# EAGLE schematic 1 (EAGLE 6.4)
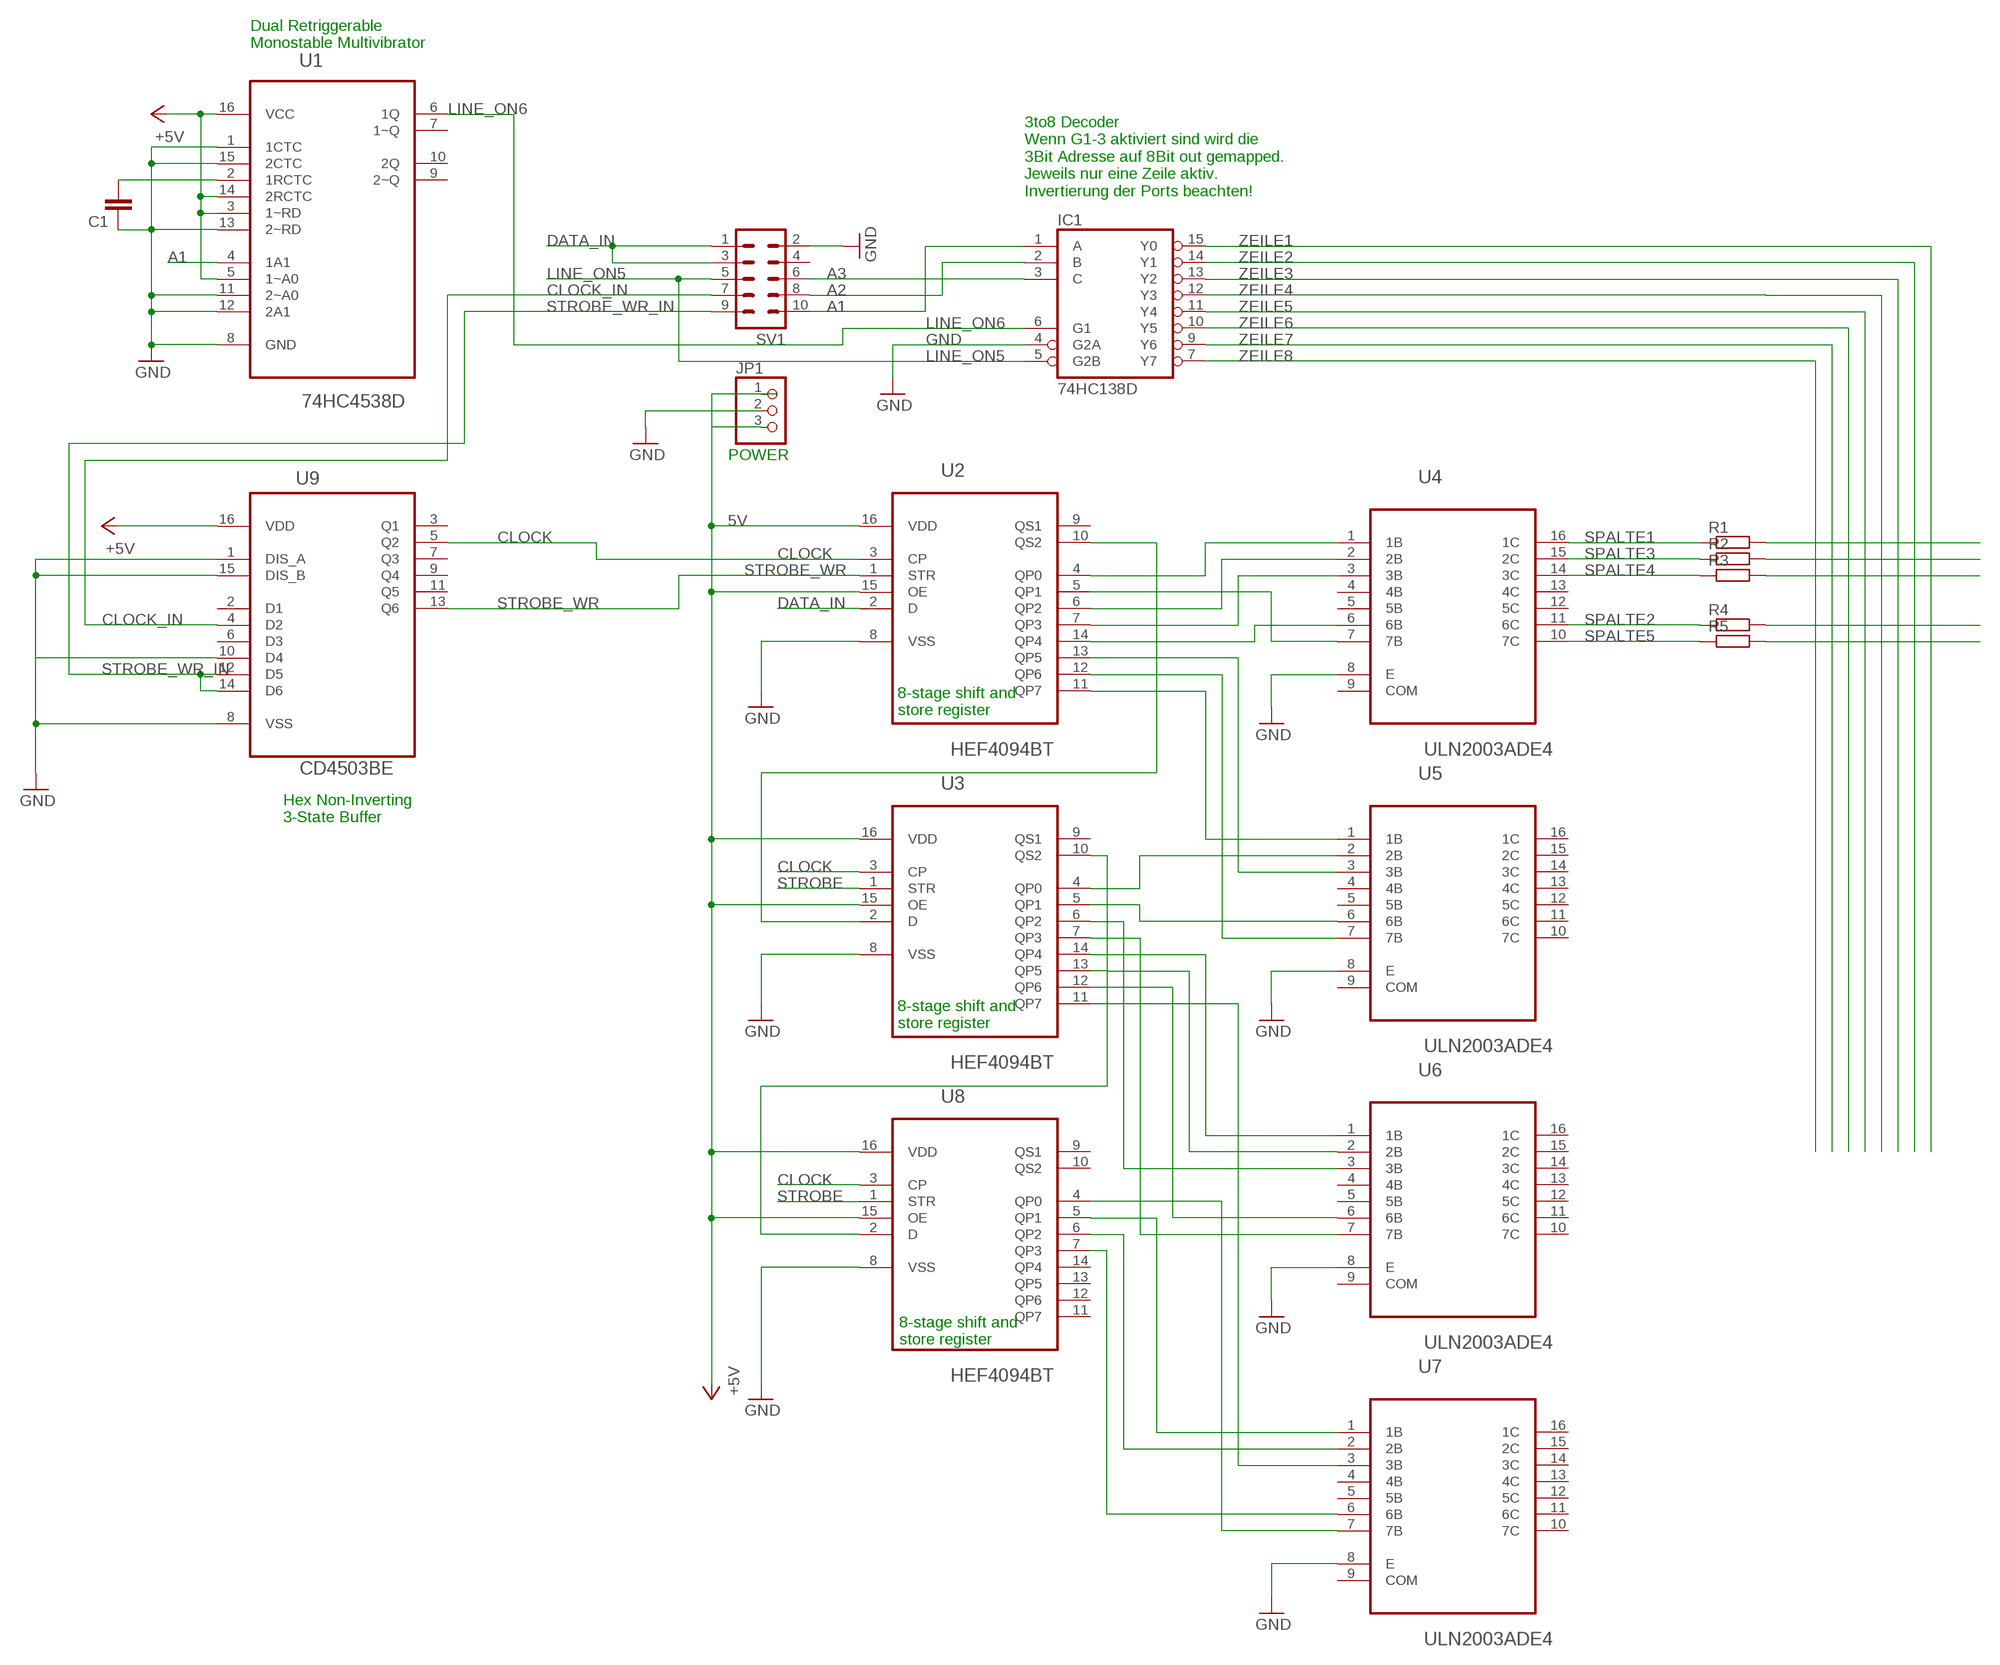
[diagram p0: schematic, sheet 1]

## Parts
C1  C-EU025-050X050  [C025-050X050]
IC1  74HC138D  [SO16]
JP1  PINHD-1X3  [1X03]
R1  R-EU_0414/15  [0414/15]
R2  R-EU_0414/15  [0414/15]
R3  R-EU_0414/15  [0414/15]
R4  R-EU_0414/15  [0414/15]
R5  R-EU_0414/15  [0414/15]
SV1  ML10  [ML10]
U1  74HC4538D  [SOIC127P600X175-16N]
U2  HEF4094BT  [SOIC127P600X175-16N]
U3  HEF4094BT  [SOIC127P600X175-16N]
U4  ULN2003ADE4  [SOIC127P600X175-16N]
U5  ULN2003ADE4  [SOIC127P600X175-16N]
U6  ULN2003ADE4  [SOIC127P600X175-16N]
U7  ULN2003ADE4  [SOIC127P600X175-16N]
U8  HEF4094BT  [SOIC127P600X175-16N]
U9  CD4503BE  [DIP254P762X508-16]

## Nets
5V: JP1.3 U2.15(OE) U2.16(VDD) U3.15(OE) U3.16(VDD) U8.15(OE) U8.16(VDD) ; supply symbol labelled +5V
+5V: U1.3(1~RD) U1.5(1~A0) U1.14(2RCTC) U1.16(VCC) U9.16(VDD)
A1: IC1.1(A) SV1.10 U1.4(1A1)
A2: IC1.2(B) SV1.8
A3: IC1.3(C) SV1.6
CLOCK: U2.3(CP) U3.3(CP) U8.3(CP) U9.5(Q2)
CLOCK_IN: SV1.7 U9.4(D2)
DATA_IN: SV1.1 SV1.3 U2.2(D)
GND: C1.1 IC1.4(G2A) JP1.2 SV1.2 U1.1(1CTC) U1.8(GND) U1.11(2~A0) U1.12(2A1) U1.13(2~RD) U1.15(2CTC) U2.8(VSS) U3.8(VSS) U4.8(E) U5.8(E) U6.8(E) U7.8(E) U8.8(VSS) U9.1(DIS_A) U9.8(VSS) U9.10(D4) U9.15(DIS_B)
LINE_ON5: IC1.5(G2B) SV1.5
LINE_ON6: IC1.6(G1) U1.6(1Q)
N$1: C1.2 U1.2(1RCTC)
N$2: U2.10(QS2) U3.2(D)
N$3: U2.4(QP0) U4.1(1B)
N$4: U2.6(QP2) U4.2(2B)
N$5: U2.7(QP3) U4.3(3B)
N$6: U2.14(QP4) U4.6(6B)
N$7: U2.5(QP1) U4.7(7B)
N$8: U2.11(QP7) U5.1(1B)
N$9: U2.12(QP6) U5.7(7B)
N$10: U2.13(QP5) U5.3(3B)
N$11: R1.2
N$12: R2.2
N$14: R4.2
N$15: R5.2
N$22: U3.4(QP0) U5.2(2B)
N$23: U3.5(QP1) U5.6(6B)
N$24: U3.6(QP2) U6.3(3B)
N$25: U3.7(QP3) U6.7(7B)
N$26: U7.7(7B) U8.4(QP0)
N$27: U3.11(QP7) U7.3(3B)
N$28: U3.12(QP6) U6.6(6B)
N$29: U3.14(QP4) U6.1(1B)
N$30: U3.13(QP5) U6.2(2B)
N$31: U7.1(1B) U8.5(QP1)
N$33: U7.2(2B) U8.6(QP2)
N$34: U7.6(6B) U8.7(QP3)
N$35: U3.10(QS2) U8.2(D)
SPALTE1: R1.1 U4.16(1C)
SPALTE2: R4.1 U4.11(6C)
SPALTE3: R2.1 U4.15(2C)
SPALTE4: R3.1 U4.14(3C)
SPALTE5: R5.1 U4.10(7C)
STROBE: U3.1(STR) U8.1(STR)
STROBE_WR: U2.1(STR) U9.13(Q6)
STROBE_WR_IN: SV1.9 U9.12(D5) U9.14(D6)
ZEILE1: IC1.15(Y0)
ZEILE2: IC1.14(Y1)
ZEILE3: IC1.13(Y2)
ZEILE4: IC1.12(Y3)
ZEILE5: IC1.11(Y4)
ZEILE6: IC1.10(Y5)
ZEILE7: IC1.9(Y6)
ZEILE8: IC1.7(Y7) R3.2
Unconnected: JP1.1 SV1.4 U1.7(1~Q) U1.9(2~Q) U1.10(2Q) U2.9(QS1) U3.9(QS1) U4.4(4B) U4.5(5B) U4.9(COM) U4.12(5C) U4.13(4C) U5.4(4B) U5.5(5B) U5.9(COM) U5.10(7C) U5.11(6C) U5.12(5C) U5.13(4C) U5.14(3C) U5.15(2C) U5.16(1C) U6.4(4B) U6.5(5B) U6.9(COM) U6.10(7C) U6.11(6C) U6.12(5C) U6.13(4C) U6.14(3C) U6.15(2C) U6.16(1C) U7.4(4B) U7.5(5B) U7.9(COM) U7.10(7C) U7.11(6C) U7.12(5C) U7.13(4C) U7.14(3C) U7.15(2C) U7.16(1C) U8.9(QS1) U8.10(QS2) U8.11(QP7) U8.12(QP6) U8.13(QP5) U8.14(QP4) U9.2(D1) U9.3(Q1) U9.6(D3) U9.7(Q3) U9.9(Q4) U9.11(Q5)

## Notes on the sheet
- Dual Retriggerable 
  Monostable Multivibrator
- 3to8 Decoder
  Wenn G1-3 aktiviert sind wird die 
  3Bit Adresse auf 8Bit out gemapped. 
  Jeweils nur eine Zeile aktiv.
  Invertierung der Ports beachten!
- POWER
- 8-stage shift and 
  store register
- Hex Non-Inverting 
  3-State Buffer
- 8-stage shift and 
  store register
- 8-stage shift and 
  store register

## Power pins joined to a net without a drawn wire
GND: IC1.8(GND)
VCC: IC1.16(VCC)

## Library data of the parts
C1 = resistor:C-EU: CAPACITOR, European symbol
IC1 = 74xx-eu:74*138: 3-line to 8-line DECODER/DEMULTIPLEXER
JP1 = pinhead:PINHD-1X3: PIN HEADER
R1-R5 = resistor:R-EU_: RESISTOR, European symbol
SV1 = con-ml:ML10: HARTING; OC_FARNELL: unknown; OC_NEWARK: unknown
U1 = debauer:74HC4538D: Dual retriggerable precision monostable multivibrator; MPN: 74HC4538D; OC_FARNELL: 1201332; OC_NEWARK: 26M7768; PACKAGE: SOIC-16; SUPPLIER: NXP
U2 U3 U8 = debauer:HEF4094BT: 8-stage shift-and-store register; MPN: HHEF4094BT; OC_FARNELL: 1201297; OC_NEWARK: 25M9623; PACKAGE: SOIC-16; SUPPLIER: NXP
U4-U7 = debauer:ULN2003ADE4: DARLINGTON TRANSISTOR ARRAYS; MPN: ULN2003ADE4; OC_FARNELL: 1125398; OC_NEWARK: 93K1078; PACKAGE: SOIC-16; SUPPLIER: Texas Instruments
U9 = debauer:CD4503BE: CMOS HEX BUFFER; MPN: CD4503BE; OC_FARNELL: 1470765; OC_NEWARK: 67K0085; PACKAGE: PDIP-16; SUPPLIER: Texas Instruments